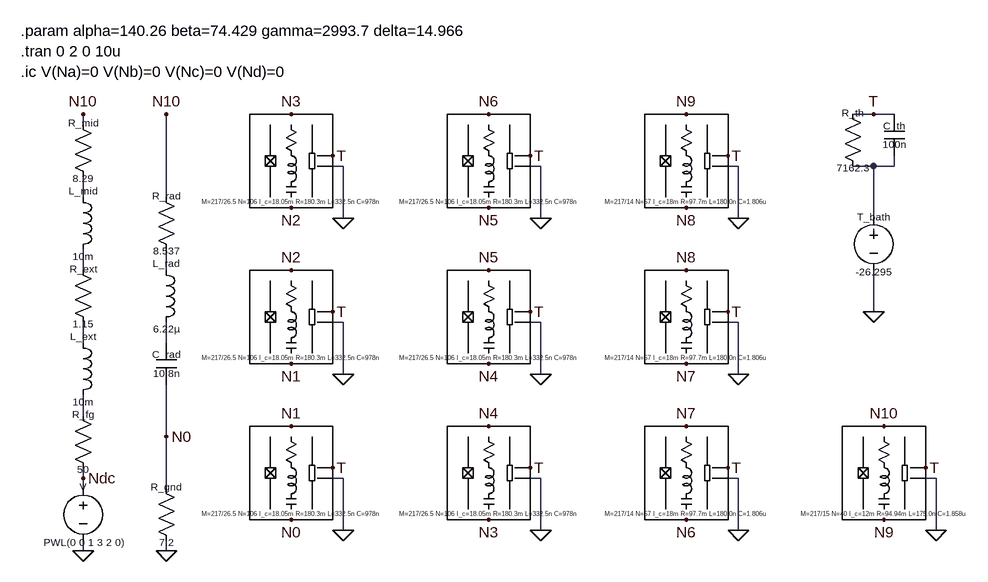
[diagram p0: schematic JPE_10stacks.asc]
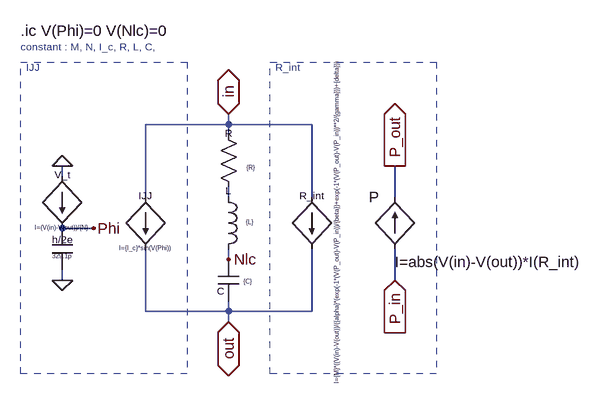
[diagram p1: sub-circuit 1stack.asc]
JPE_10stacks.asc, the LTspice schematic file:
Version 4
SHEET 1 1820 680
WIRE 1632 -512 1600 -512
WIRE 1664 -512 1632 -512
WIRE 416 -496 416 -512
WIRE 816 -432 800 -432
WIRE 1120 -432 1104 -432
WIRE 1424 -432 1408 -432
WIRE 1632 -432 1600 -432
WIRE 1664 -432 1664 -448
WIRE 1664 -432 1632 -432
WIRE 416 -384 416 -416
WIRE 544 -384 544 -512
WIRE 816 -352 816 -432
WIRE 1120 -352 1120 -432
WIRE 1424 -352 1424 -432
WIRE 1632 -352 1632 -432
WIRE 1632 -320 1632 -336
WIRE 416 -272 416 -304
WIRE 544 -272 544 -304
WIRE 1632 -208 1632 -272
WIRE 816 -192 800 -192
WIRE 1120 -192 1104 -192
WIRE 1424 -192 1408 -192
WIRE 416 -160 416 -192
WIRE 544 -160 544 -192
WIRE 816 -112 816 -192
WIRE 1120 -112 1120 -192
WIRE 1424 -112 1424 -192
WIRE 416 -48 416 -80
WIRE 544 -16 544 -96
WIRE 416 48 416 32
WIRE 816 48 800 48
WIRE 1120 48 1104 48
WIRE 1424 48 1408 48
WIRE 1728 48 1712 48
WIRE 416 64 416 48
WIRE 544 64 544 -16
WIRE 816 128 816 48
WIRE 1120 128 1120 48
WIRE 1424 128 1424 48
WIRE 1728 128 1728 48
WIRE 416 160 416 144
WIRE 544 160 544 144
FLAG 416 160 0
FLAG 544 -16 N0
FLAG 1632 -208 0
FLAG 544 -512 N10
FLAG 416 48 Ndc
FLAG 544 160 0
FLAG 416 -512 N10
FLAG 1632 -512 T
FLAG 1040 -368 N5
FLAG 1040 -512 N6
FLAG 1104 -448 T
FLAG 1120 -352 0
FLAG 1344 -368 N8
FLAG 1344 -512 N9
FLAG 1408 -448 T
FLAG 1424 -352 0
FLAG 1648 112 N9
FLAG 1648 -32 N10
FLAG 1712 32 T
FLAG 1728 128 0
FLAG 1344 -128 N7
FLAG 1344 -272 N8
FLAG 1408 -208 T
FLAG 1424 -112 0
FLAG 1344 112 N6
FLAG 1344 -32 N7
FLAG 1408 32 T
FLAG 1424 128 0
FLAG 1040 -128 N4
FLAG 1040 -272 N5
FLAG 1104 -208 T
FLAG 1120 -112 0
FLAG 1040 112 N3
FLAG 1040 -32 N4
FLAG 1104 32 T
FLAG 1120 128 0
FLAG 736 -368 N2
FLAG 736 -512 N3
FLAG 800 -448 T
FLAG 816 -352 0
FLAG 736 -128 N1
FLAG 736 -272 N2
FLAG 800 -208 T
FLAG 816 -112 0
FLAG 736 112 N0
FLAG 736 -32 N1
FLAG 800 32 T
FLAG 816 128 0
SYMBOL voltage 416 48 R0
WINDOW 0 0 24 Bottom 1
WINDOW 3 0 88 Top 1
SYMATTR InstName V
SYMATTR Value PWL(0 0 1 3 2 0)
SYMBOL res 400 -64 R0
WINDOW 0 16 24 Bottom 1
WINDOW 3 16 88 Top 1
SYMATTR InstName R_fg
SYMATTR Value 50
SYMBOL ind 400 -176 R0
WINDOW 0 16 16 Bottom 1
WINDOW 3 16 96 Top 1
SYMATTR InstName L_ext
SYMATTR Value 10m
SYMBOL res 400 -288 R0
WINDOW 0 16 24 Bottom 1
WINDOW 3 16 88 Top 1
SYMATTR InstName R_ext
SYMATTR Value 1.15
SYMBOL ind 400 -400 R0
WINDOW 0 16 16 Bottom 1
WINDOW 3 16 96 Top 1
SYMATTR InstName L_mid
SYMATTR Value 10m
SYMBOL ind 528 -288 R0
WINDOW 0 16 16 Bottom 1
WINDOW 3 16 96 Top 1
SYMATTR InstName L_rad
SYMATTR Value 6.22µ
SYMBOL res 528 -400 R0
WINDOW 0 16 24 Bottom 1
WINDOW 3 16 88 Top 1
SYMATTR InstName R_rad
SYMATTR Value 8.537
SYMBOL cap 528 -160 R0
WINDOW 0 16 28 Bottom 1
WINDOW 3 16 36 Top 1
SYMATTR InstName C_rad
SYMATTR Value 10.8n
SYMBOL res 528 48 R0
WINDOW 0 16 24 Bottom 1
WINDOW 3 16 88 Top 1
SYMATTR InstName R_gnd
SYMATTR Value 7.2
SYMBOL voltage 1632 -368 R0
WINDOW 0 0 24 Bottom 1
WINDOW 3 0 88 Top 1
SYMATTR InstName T_bath
SYMATTR Value -26.295
SYMBOL res 1584 -528 R0
WINDOW 0 16 24 Bottom 1
WINDOW 3 16 88 Top 1
SYMATTR InstName R_th
SYMATTR Value 7162.3
SYMBOL cap 1648 -512 R0
WINDOW 0 16 28 Bottom 1
WINDOW 3 16 36 Top 1
SYMATTR InstName C_th
SYMATTR Value 100n
SYMBOL res 400 -512 R0
WINDOW 0 16 24 Bottom 1
WINDOW 3 16 88 Top 1
SYMATTR InstName R_mid
SYMATTR Value 8.29
SYMBOL 1stack 1040 -448 R0
WINDOW 0 0 -64 Invisible 1
WINDOW 39 0 64 Top 0
SYMATTR InstName X4
SYMATTR SpiceLine M=217/26.5 N=106 I_c=18.05m R=180.3m L=332.5n C=978n
SYMBOL 1stack 1344 -448 R0
WINDOW 0 0 -64 Invisible 1
WINDOW 39 0 64 Top 0
SYMATTR InstName X7
SYMATTR SpiceLine M=217/14 N=57 I_c=18m R=97.7m L=180.0n C=1.806u
SYMBOL 1stack 1648 32 R0
WINDOW 0 0 -64 Invisible 1
WINDOW 39 0 64 Top 0
SYMATTR InstName X10
SYMATTR SpiceLine M=217/15 N=40 I_c=12m R=94.94m L=175.0n C=1.858u
SYMBOL 1stack 1344 -208 R0
WINDOW 0 0 -64 Invisible 1
WINDOW 39 0 64 Top 0
SYMATTR InstName X8
SYMATTR SpiceLine M=217/14 N=57 I_c=18m R=97.7m L=180.0n C=1.806u
SYMBOL 1stack 1344 32 R0
WINDOW 0 0 -64 Invisible 1
WINDOW 39 0 64 Top 0
SYMATTR InstName X9
SYMATTR SpiceLine M=217/14 N=57 I_c=18m R=97.7m L=180.0n C=1.806u
SYMBOL 1stack 1040 -208 R0
WINDOW 0 0 -64 Invisible 1
WINDOW 39 0 64 Top 0
SYMATTR InstName X1
SYMATTR SpiceLine M=217/26.5 N=106 I_c=18.05m R=180.3m L=332.5n C=978n
SYMBOL 1stack 1040 32 R0
WINDOW 0 0 -64 Invisible 1
WINDOW 39 0 64 Top 0
SYMATTR InstName X2
SYMATTR SpiceLine M=217/26.5 N=106 I_c=18.05m R=180.3m L=332.5n C=978n
SYMBOL 1stack 736 -448 R0
WINDOW 0 0 -64 Invisible 1
WINDOW 39 0 64 Top 0
SYMATTR InstName X3
SYMATTR SpiceLine M=217/26.5 N=106 I_c=18.05m R=180.3m L=332.5n C=978n
SYMBOL 1stack 736 -208 R0
WINDOW 0 0 -64 Invisible 1
WINDOW 39 0 64 Top 0
SYMATTR InstName X5
SYMATTR SpiceLine M=217/26.5 N=106 I_c=18.05m R=180.3m L=332.5n C=978n
SYMBOL 1stack 736 32 R0
WINDOW 0 0 -64 Invisible 1
WINDOW 39 0 64 Top 0
SYMATTR InstName X6
SYMATTR SpiceLine M=217/26.5 N=106 I_c=18.05m R=180.3m L=332.5n C=978n
TEXT 320 -640 Left 2 !.param alpha=140.26 beta=74.429 gamma=2993.7 delta=14.966\n.tran 0 2 0 10u\n.ic V(Na)=0 V(Nb)=0 V(Nc)=0 V(Nd)=0

1stack.asc, the sub-circuit schematic file:
Version 4
SHEET 1 880 680
WIRE 224 16 224 0
WIRE 224 16 96 16
WIRE 352 16 224 16
WIRE 224 32 224 16
WIRE -32 96 -32 80
WIRE 96 128 96 16
WIRE 224 128 224 112
WIRE 352 128 352 16
WIRE 480 128 480 80
WIRE 16 176 -32 176
WIRE 224 224 224 208
WIRE -32 256 -32 240
WIRE 480 256 480 208
WIRE 96 304 96 208
WIRE 224 304 224 288
WIRE 224 304 96 304
WIRE 352 304 352 208
WIRE 352 304 224 304
WIRE 224 320 224 304
FLAG 224 0 in
IOPIN 224 0 BiDir
FLAG 224 320 out
IOPIN 224 320 BiDir
FLAG 480 80 P_out
IOPIN 480 80 Out
FLAG 480 256 P_in
IOPIN 480 256 In
FLAG -32 80 0
FLAG -32 256 0
FLAG 16 176 Phi
FLAG 224 224 Nlc
SYMBOL bi 96 128 R0
WINDOW 0 0 8 Bottom 1
WINDOW 3 0 72 Top 0
SYMATTR InstName IJJ
SYMATTR Value I={I_c}*sin(V(Phi))
SYMBOL bi 352 128 R0
WINDOW 0 0 8 Bottom 1
WINDOW 3 32 32 VTop 0
SYMATTR InstName R_int
SYMATTR Value I={M}*((V(in)-V(out))/({alpha}*(exp(-1*(V(P_out)-V(P_in))/{beta})+exp(-1*(V(P_out)-V(P_in))**2/{gamma}))+{delta}))
SYMBOL res 208 16 R0
WINDOW 0 16 24 Bottom 1
WINDOW 3 51 60 Top 0
SYMATTR InstName R
SYMATTR Value {R}
SYMBOL cap 208 224 R0
WINDOW 0 4 38 Top 1
WINDOW 3 46 27 Top 0
SYMATTR InstName C
SYMATTR Value {C}
SYMBOL bi 480 208 R180
WINDOW 0 24 80 Left 2
WINDOW 3 -290 -20 Left 2
SYMATTR InstName P
SYMATTR Value I=abs(V(in)-V(out))*I(R_int)
SYMBOL bi -32 96 R0
WINDOW 0 0 8 Bottom 1
WINDOW 3 0 72 Top 0
SYMATTR InstName V_t
SYMATTR Value I=(V(in)-V(out))/{N}
SYMBOL cap -48 176 R0
WINDOW 0 16 28 Bottom 1
WINDOW 3 16 36 Top 0
SYMATTR InstName h/2e
SYMATTR Value 329.1p
SYMBOL ind 208 112 R0
WINDOW 0 16 16 Bottom 1
WINDOW 3 49 48 Top 0
SYMATTR InstName L
SYMATTR Value {L}
TEXT -96 -104 Left 1 ;constant : M, N, I_c, R, L, C,
TEXT -88 -72 Left 1 ;IJJ
TEXT 296 -72 Left 1 ;R_int
TEXT -96 -128 Left 2 !.ic V(Phi)=0 V(Nlc)=0
RECTANGLE Normal -96 -80 160 400 2
RECTANGLE Normal 544 400 288 -80 2

The netlist it stands for:
* JPE_10stacks.asc
V Ndc 0 PWL(0 0 1 3 2 0)
R_fg N008 Ndc 50
L_ext N006 N008 10m
R_ext N004 N006 1.15
L_mid N002 N004 10m
L_rad N005 N007 6.22µ
R_rad N10 N005 8.537
C_rad N007 N0 10.8n
R_gnd N0 0 7.2
V§T_bath N001 0 -26.295
R_th T N001 7162.3
C_th T N001 100n
R_mid N10 N002 8.29
XX4 N6 N5 T 0 1stack params: M=217/26.5 N=106 I_c=18.05m R=180.3m L=332.5n C=978n
XX7 N9 N8 T 0 1stack params: M=217/14 N=57 I_c=18m R=97.7m L=180.0n C=1.806u
XX10 N10 N9 T 0 1stack params: M=217/15 N=40 I_c=12m R=94.94m L=175.0n C=1.858u
XX8 N8 N7 T 0 1stack params: M=217/14 N=57 I_c=18m R=97.7m L=180.0n C=1.806u
XX9 N7 N6 T 0 1stack params: M=217/14 N=57 I_c=18m R=97.7m L=180.0n C=1.806u
XX1 N5 N4 T 0 1stack params: M=217/26.5 N=106 I_c=18.05m R=180.3m L=332.5n C=978n
XX2 N4 N3 T 0 1stack params: M=217/26.5 N=106 I_c=18.05m R=180.3m L=332.5n C=978n
XX3 N3 N2 T 0 1stack params: M=217/26.5 N=106 I_c=18.05m R=180.3m L=332.5n C=978n
XX5 N2 N1 T 0 1stack params: M=217/26.5 N=106 I_c=18.05m R=180.3m L=332.5n C=978n
XX6 N1 N0 T 0 1stack params: M=217/26.5 N=106 I_c=18.05m R=180.3m L=332.5n C=978n

* block symbol definitions
.subckt 1stack in out P_out P_in
B§IJJ in out I={I_c}*sin(V(Phi))
B§R_int in out I={M}*((V(in)-V(out))/({alpha}*(exp(-1*(V(P_out)-V(P_in))/{beta})+exp(-1*(V(P_out)-V(P_in))**2/{gamma}))+{delta}))
R in N001 {R}
C Nlc out {C}
B§P P_in P_out I=abs(V(in)-V(out))*I(R_int)
B§V_t 0 Phi I=(V(in)-V(out))/{N}
C§h/2e Phi 0 329.1p
L N001 Nlc {L}
* constant : M, N, I_c, R, L, C,
* IJJ
* R_int
.ic V(Phi)=0 V(Nlc)=0
.ends 1stack

.param alpha=140.26 beta=74.429 gamma=2993.7 delta=14.966
.tran 0 2 0 10u
.ic V(Na)=0 V(Nb)=0 V(Nc)=0 V(Nd)=0
.backanno
.end